# Altium schematic sheet Radio.SchDoc
size A3
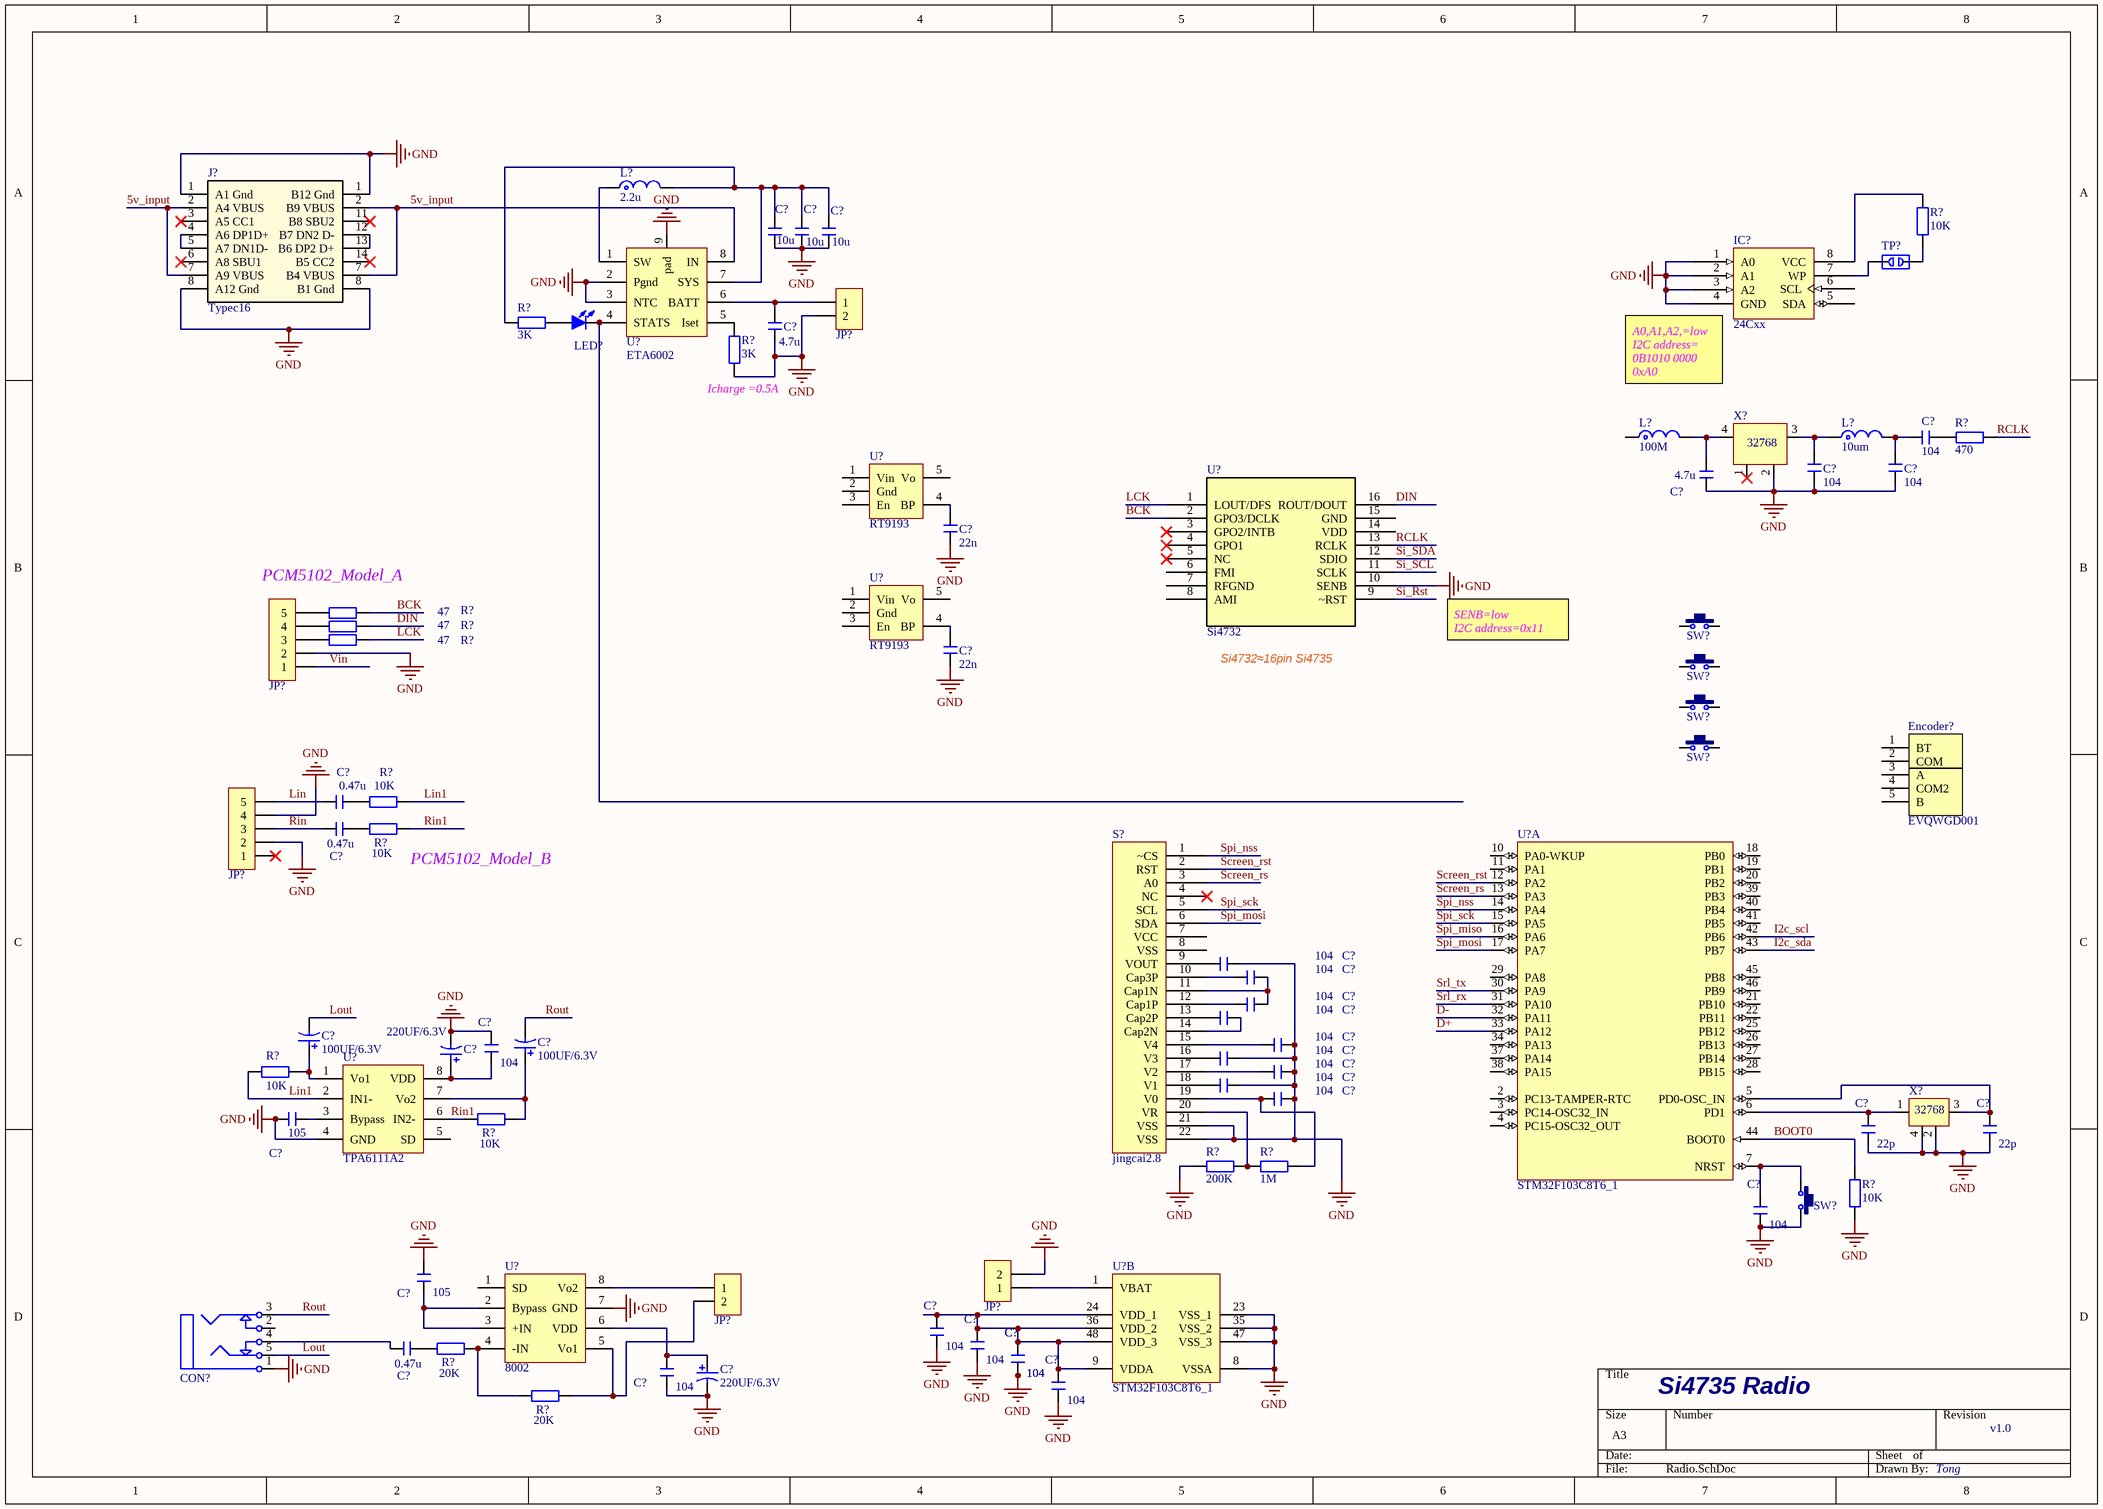
[diagram p0: Radio.SchDoc]

## Parts
(Parts that share a designator on the sheet are numbered #1, #2 ... from top to bottom, then left to right.)
C?#1  10u  [C 0603]
C?#2  10u  [C 0603]
C?#3  10u  [C 0603]
C?#4  4.7u  [C 0603]
C?#5  104  [C 0603]
C?#6  104  [C 0603]
C?#7  104  [C 0603]
C?#8  4.7u  [C 0603]
C?#9  22n  [C 0603]
C?#10  22n  [C 0603]
C?#11  0.47u  [C 0603]
C?#12  0.47u  [C 0603]
C?#13  104  [C 0603]
C?#14  104  [C 0603]
C?#15  104  [C 0603]
C?#16  104  [C 0603]
C?#17  100UF/6.3V  [CAP 2.5*5*11]
C?#18  100UF/6.3V  [CAP 2.5*5*11]
C?#19  104  [C 0603]
C?#20  220UF/6.3V  [CAP 2.5*5*6.3]
C?#21  104  [C 0603]
C?#22  104  [C 0603]
C?#23  104  [C 0603]
C?#24  104  [C 0603]
C?#25  104  [C 0603]
C?#26  105  [C 0603]
C?#27  22p  [C 0603]
C?#28  22p  [C 0603]
C?#29  104  [C 0603]
C?#30  105  [C 0603]
C?#31  104  [C 0603]
C?#32  0.47u  [C 0603]
C?#33  104  [C 0603]
C?#34  104  [C 0603]
C?#35  104  [C 0603]
C?#36  104  [C 0603]
C?#37  220UF/6.3V  [CAP 2.5*5*6.3]
C?#38  104  [C 0603]
CON?  3F07_BK  [PJ325_PK]  (value not drawn)
Encoder?  EVQWGD001  [EVQWGD001]
IC?  24Cxx  [SOP8_L]
J?  Typec16  [typec 16p]
JP?#1  HDR-1X2  [HDR-1X2]  (value not drawn)
JP?#2  HDR-1X5  [HDR-1X5]  (value not drawn)
JP?#3  HDR-1X5  [HDR-1X5]  (value not drawn)
JP?#4  HDR-1X2  [HDR-1x2_top]  (value not drawn)
JP?#5  HDR-1X2  [HDR-1X2]  (value not drawn)
L?#1  2.2u  [L 0805]
L?#2  100M  [L 0805]
L?#3  10um  [L 1806]
LED?  (no value)  [LED 0603B]
R?#1  10K  [Res-SMD-0603]
R?#2  3K  [Res-SMD-0603]
R?#3  3K  [Res-SMD-0603]
R?#4  470  [Res-SMD-0603]
R?#5  47  [Res-SMD-0603]
R?#6  47  [Res-SMD-0603]
R?#7  47  [Res-SMD-0603]
R?#8  10K  [Res-SMD-0603]
R?#9  10K  [Res-SMD-0603]
R?#10  10K  [Res-SMD-0603]
R?#11  10K  [Res-SMD-0603]
R?#12  200K  [Res-SMD-0603]
R?#13  1M  [Res-SMD-0603]
R?#14  10K  [Res-SMD-0603]
R?#15  20K  [Res-SMD-0603]
R?#16  20K  [Res-SMD-0603]
S?  jingcai2.8  [Screem]
SW?#1  6x6x5  [TSW SMD-6*6*5]  (value not drawn)
SW?#2  6x6x5  [TSW SMD-6*6*5]  (value not drawn)
SW?#3  6x6x5  [TSW SMD-6*6*5]  (value not drawn)
SW?#4  6x6x5  [TSW SMD-6*6*5]  (value not drawn)
SW?#5  6x6x5  [TSW SMD-6*6*5]  (value not drawn)
TP?  (no value)  [DEBUG PAD2]
U?#1  ETA6002  [SOP8_L_PAD]
U?#2  RT9193  [SOT23-5L]
U?#3  Si4732  [SOP16_L]
U?#4  RT9193  [SOT23-5L]
U?#5  STM32F103C8T6_1  [LQFP48 7X7_N]  (part A of 2)
U?#6  TPA6111A2  [SOP8_N]
U?#7  8002  [SOP8_N]
U?#8  STM32F103C8T6_1  [LQFP48 7X7_N]  (part B of 2)
X?#1  32768  [XTAL-3225]
X?#2  32768  [XTAL-3225]

## Nets
GND: C?#1.2 C?#2.2 C?#3.2 C?#4.2 C?#6.2 C?#7.2 C?#8.2 C?#9.1 C?#10.1 C?#13.1 C?#19.1 C?#20.K C?#21.2 C?#22.1 C?#23.1 C?#24.1 C?#25.1 C?#26.1 C?#27.1 C?#28.1 C?#29.1 C?#30.2 C?#31.1 C?#33.1 C?#34.1 C?#35.1 C?#36.1 C?#37.K C?#38.1 CON?.1 IC?.1(A0) IC?.2(A1) IC?.3(A2) IC?.4(GND) J?.1(A1_Gnd) J?.8(A12_Gnd) JP?#1.2 JP?#2.2 JP?#3.2 JP?#3.4 JP?#5.2 R?#3.1 R?#12.2 R?#14.1 S?.21(VSS) S?.22(VSS) SW?#5.2 U?#1.2(Pgnd) U?#1.3(NTC) U?#1.9(pad) U?#3.10(SENB) U?#6.4(GND) U?#7.7(GND) U?#8.8(VSSA) U?#8.23(VSS_1) U?#8.35(VSS_2) U?#8.47(VSS_3) X?#1.2 X?#2.2 X?#2.4
5v_input: J?.2(A4_VBUS) J?.7(A9_VBUS) U?#1.8(IN)
BCK: R?#5.2 U?#3.2(GPO3/DCLK)
BOOT0: R?#14.2 U?#5.44(BOOT0)
D+: U?#5.33(PA12)
D-: U?#5.32(PA11)
DIN: R?#6.2 U?#3.16(ROUT/DOUT)
I2c_scl: U?#5.42(PB6)
I2c_sda: U?#5.43(PB7)
LCK: R?#7.2 U?#3.1(LOUT/DFS)
Lin: C?#11.1 JP?#3.5
Lin1: R?#8.2 R?#10.1 U?#6.2(IN1-)
Lout: C?#17.K CON?.5
RCLK: R?#4.1 U?#3.13(RCLK)
Rin: C?#12.1 JP?#3.3
Rin1: R?#9.2 R?#11.1 U?#6.6(IN2-)
Rout: C?#18.K CON?.3
Screen_rs: S?.3(A0) U?#5.13(PA3)
Screen_rst: S?.2(RST) U?#5.12(PA2)
Si_Rst: U?#3.9(~RST)
Si_SCL: U?#3.11(SCLK)
Si_SDA: U?#3.12(SDIO)
Spi_miso: U?#5.16(PA6)
Spi_mosi: S?.6(SDA) U?#5.17(PA7)
Spi_nss: S?.1(~CS) U?#5.14(PA4)
Spi_sck: S?.5(SCL) U?#5.15(PA5)
Srl_rx: U?#5.31(PA10)
Srl_tx: U?#5.30(PA9)
Vin: JP?#2.1
NetC?#1_1: C?#1.1 C?#2.1 C?#3.1 L?#1.2 R?#2.2 U?#1.7(SYS)
NetC?#4_1: C?#4.1 JP?#1.1 U?#1.6(BATT)
NetC?#5_1: C?#5.1 C?#7.1 L?#3.2
NetC?#5_2: C?#5.2 R?#4.2
NetC?#6_1: C?#6.1 L?#3.1 X?#1.3
NetC?#8_1: C?#8.1 L?#2.2 X?#1.4
NetC?#9_2: C?#9.2 U?#2.4(BP)
NetC?#10_2: C?#10.2 U?#4.4(BP)
NetC?#11_2: C?#11.2 R?#8.1
NetC?#12_2: C?#12.2 R?#9.1
NetC?#13_2: C?#13.2 S?.9(VOUT)
NetC?#14_1: C?#14.1 C?#15.1 S?.11(Cap1N)
NetC?#14_2: C?#14.2 S?.10(Cap3P)
NetC?#15_2: C?#15.2 S?.12(Cap1P)
NetC?#16_1: C?#16.1 S?.14(Cap2N)
NetC?#16_2: C?#16.2 S?.13(Cap2P)
NetC?#17_A: C?#17.A R?#10.2 U?#6.1(Vo1)
NetC?#18_A: C?#18.A R?#11.2 U?#6.7(Vo2)
NetC?#19_2: C?#19.2 S?.15(V4)
NetC?#20_A: C?#20.A C?#21.1 U?#6.8(VDD)
NetC?#22_2: C?#22.2 S?.16(V3)
NetC?#23_2: C?#23.2 S?.17(V2)
NetC?#24_2: C?#24.2 S?.18(V1)
NetC?#25_2: C?#25.2 R?#13.1 S?.19(V0)
NetC?#26_2: C?#26.2 U?#6.3(Bypass)
NetC?#27_2: C?#27.2 U?#5.6(PD1) X?#2.1
NetC?#28_2: C?#28.2 U?#5.5(PD0-OSC_IN) X?#2.3
NetC?#29_2: C?#29.2 SW?#5.1 U?#5.7(NRST)
NetC?#30_1: C?#30.1 U?#7.2(Bypass) U?#7.3(+IN)
NetC?#31_2: C?#31.2 C?#33.2 C?#34.2 C?#35.2 C?#38.2 U?#8.9(VDDA) U?#8.24(VDD_1) U?#8.36(VDD_2) U?#8.48(VDD_3)
NetC?#32_1: C?#32.1 CON?.4
NetC?#32_2: C?#32.2 R?#15.1
NetC?#36_2: C?#36.2 C?#37.A U?#7.6(VDD)
NetIC?_7: IC?.7(WP) TP?.1
NetIC?_8: IC?.8(VCC) R?#1.2
NetJ?_4: J?.4(A6_DP1D+) J?.5(A7_DN1D-)
NetJ?_12: J?.12(B7_DN2_D-) J?.13(B6_DP2_D+)
NetJP?#2_3: JP?#2.3 R?#7.1
NetJP?#2_4: JP?#2.4 R?#6.1
NetJP?#2_5: JP?#2.5 R?#5.1
NetJP?#4_1: JP?#4.1 U?#7.8(Vo2)
NetJP?#4_2: JP?#4.2 R?#16.2 U?#7.5(Vo1)
NetJP?#5_1: JP?#5.1 U?#8.1(VBAT)
NetL?#1_1: L?#1.1 U?#1.1(SW)
NetLED?_1: LED?.1(A) R?#2.1
NetLED?_2: LED?.2(K) U?#1.4(STATS)
NetR?#1_1: R?#1.1 TP?.2
NetR?#3_2: R?#3.2 U?#1.5(Iset)
NetR?#12_1: R?#12.1 R?#13.2 S?.20(VR)
NetR?#15_2: R?#15.2 R?#16.1 U?#7.4(-IN)

Not connected (* = marked no-connect by the designer): CON? 2; Encoder? 1(BT) 2(COM) 3(A) 4(COM2) 5(B); IC? 5(SDA) 6(SCL); J? 3(A5_CC1)* 6(A8_SBU1)* 11(B8_SBU2)* 14(B5_CC2)*; JP?#3 1*; L?#2 1; S? 4(NC)* 7(VCC) 8(VSS); SW?#1 1 2; SW?#2 1 2; SW?#3 1 2; SW?#4 1 2; U?#2 1(Vin) 2(Gnd) 3(En) 5(Vo); U?#3 3(GPO2/INTB)* 4(GPO1)* 5(NC)* 6(FMI) 7(RFGND) 8(AMI) 14(VDD) 15(GND); U?#4 1(Vin) 2(Gnd) 3(En) 5(Vo); U?#5 2(PC13-TAMPER-RTC) 3(PC14-OSC32_IN) 4(PC15-OSC32_OUT) 10(PA0-WKUP) 11(PA1) 18(PB0) 19(PB1) 20(PB2) 21(PB10) 22(PB11) 25(PB12) 26(PB13) 27(PB14) 28(PB15) 29(PA8) 34(PA13) 37(PA14) 38(PA15) 39(PB3) 40(PB4) 41(PB5) 45(PB8) 46(PB9); U?#6 5(SD); U?#7 1(SD); X?#1 1*

## Notes on the sheet
- (near IC?) A0,A1,A2,=low
  I2C address=
  0B1010 0000
  0xA0
- (near R?#3) Icharge =0.5A
- PCM5102_Model_A
- SENB=low
  I2C address=0x11
- Si4732≈16pin Si4735
- (near R?#9) PCM5102_Model_B
- Si4735 Radio
- v1.0
- Tong

## Library data of the parts
C?#1-C?#16 C?#19 C?#21-C?#36 C?#38 = Cap-CER-SMD: 瓷片电容-贴片
C?#17 C?#18 C?#20 C?#37 = Cap-AE-RAD: 铝电解电容-直插
CON? = 3F07: 3.5mm耳机插座; BOM名称: 耳机插座; 版权归属: 源创客; 学习资源: www.ooocke.com
IC? = 24Cxx: 外置EEPROM; 版权归属: 源创客; BOM名称: 外置EEPROM; 学习资源: www.ooocke.com
JP?#1 JP?#4 JP?#5 = Header 2: 2P接插件; 版权归属: 源创客; BOM名称: 2P接插件; 学习资源: www.ooocke.com
JP?#2 JP?#3 = Header 5: 5P接插件; 版权归属: 源创客; BOM名称: 5P接插件; 学习资源: www.ooocke.com
L?#1-L?#3 = Ind-Beads-SMD: 贴片电感-小功率
LED? = LED-SMD: 贴片LED
R?#1-R?#16 = Res-Fixed-SMD: 固定电阻器-贴片
S? = screem2.8
SW?#1-SW?#5 = BT SMD-6x6x5: 贴片6x6轻触开关; 版权归属: 源创客; BOM名称: 贴片6x6轻触开关; 学习资源: www.ooocke.com
TP? = DEBUG: 调试断点焊盘; 版权归属: 源创客; BOM名称: 调试断点焊盘; 学习资源: www.ooocke.com
U?#1 = ETA6002: power amp; BOM名称: 单路时基芯片; 版权归属: 源创客; 学习资源: www.ooocke.com
U?#5 U?#8 = STM32F103C8T6_1: Flaah:64/RAM:20/IO:36; BOM名称: 32位STM单片机; 版权归属: 源创客; 学习资源: www.ooocke.com
U?#6 = TPA6111A2: headphone amp; BOM名称: 单路时基芯片; 版权归属: 源创客; 学习资源: www.ooocke.com
U?#7 = 8002: power amp; BOM名称: 单路时基芯片; 版权归属: 源创客; 学习资源: www.ooocke.com
X?#1 = XTAL-4: 4脚晶振
X?#2 = XTAL-4_1: 4脚晶振